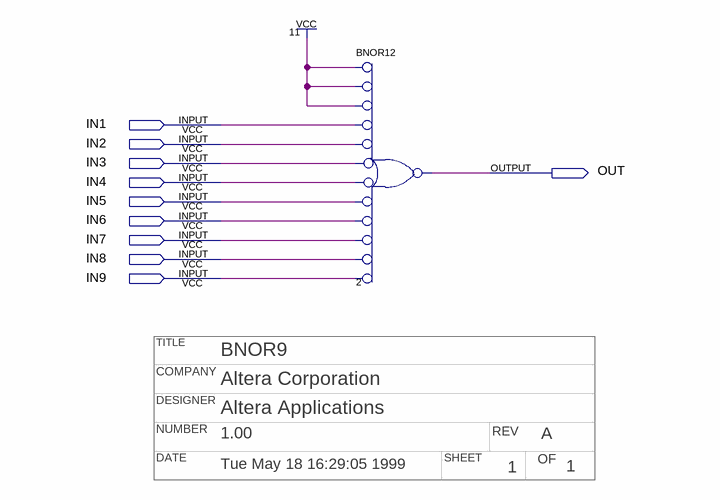
[diagram p0: schematic sheet]
// Quartus schematic bnor9.bdf as structural Verilog: 1 symbols, 10 pins
// Title block: TITLE: BNOR9; COMPANY: Altera Corporation; DESIGNER: Altera Applications; NUMBER: 1.00; REV: A; DATE: Tue May 18 16:29:05 1999; SHEET: 1; OF: 1
module bnor9 (
  input  IN1,
  input  IN2,
  input  IN3,
  input  IN4,
  input  IN5,
  input  IN6,
  input  IN7,
  input  IN8,
  input  IN9,
  output OUT
);

  nor u_2 (OUT, ~1'b1, ~1'b1, ~1'b1, ~IN1, ~IN2, ~IN3, ~IN4, ~IN5, ~IN6, ~IN7, ~IN8, ~IN9);  // BNOR12
endmodule
